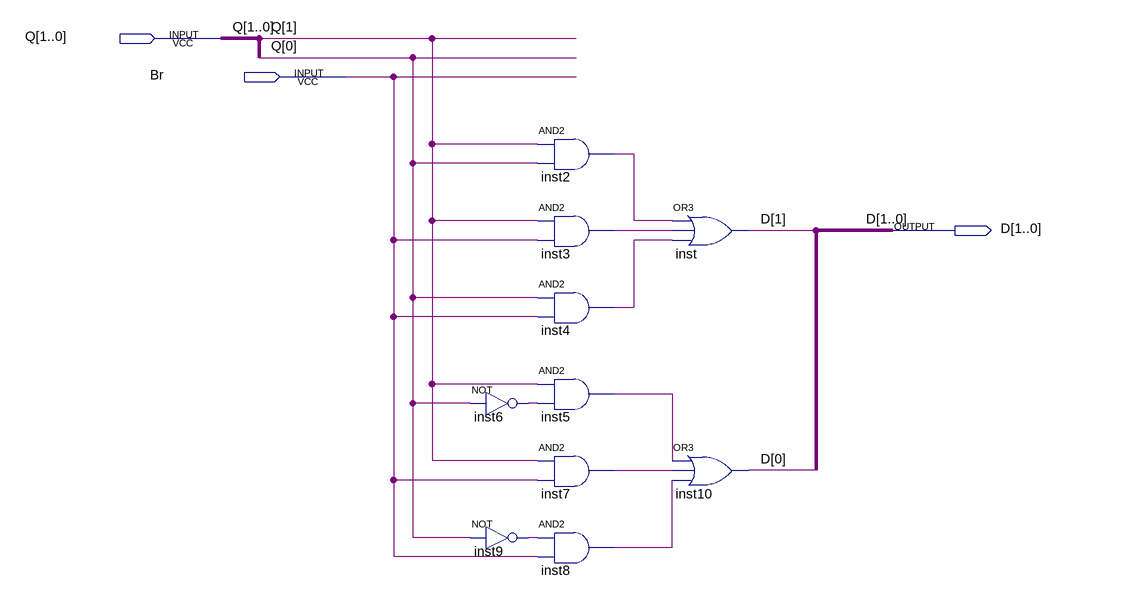
[diagram p0: schematic sheet]
// Quartus schematic Update_HBT.bdf as structural Verilog: 10 symbols, 3 pins
module Update_HBT (
  input  [1:0] Q,
  input  Br,
  output [1:0] D
);

  wire inst2_out, inst3_out, inst4_out, inst5_out, inst6_out, inst7_out, inst8_out, inst9_out;

  not inst6 (inst6_out, Q[0]);
  not inst9 (inst9_out, Q[0]);
  and inst2 (inst2_out, Q[1], Q[0]);
  and inst3 (inst3_out, Q[1], Br);
  and inst4 (inst4_out, Q[0], Br);
  and inst5 (inst5_out, Q[1], inst6_out);
  and inst7 (inst7_out, Q[1], Br);
  and inst8 (inst8_out, inst9_out, Br);
  or inst (D[1], inst2_out, inst3_out, inst4_out);
  or inst10 (D[0], inst5_out, inst7_out, inst8_out);
endmodule
